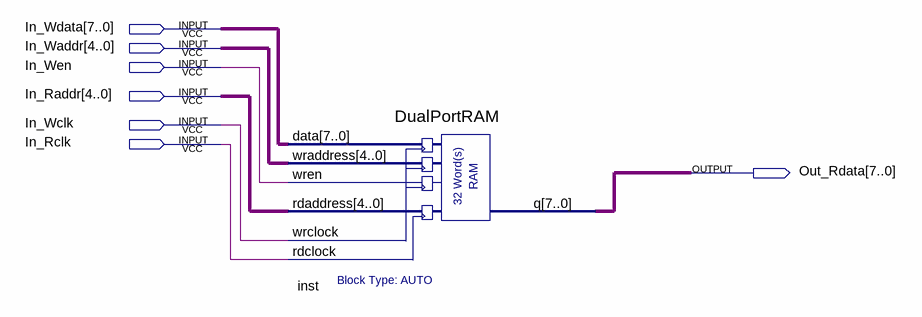
[diagram p0: schematic sheet]
// Quartus schematic TOP.bdf as structural Verilog: 1 symbols, 7 pins
module TOP (
  input  [7:0] In_Wdata,
  input  [4:0] In_Waddr,
  input  In_Wen,
  input  [4:0] In_Raddr,
  input  In_Wclk,
  input  In_Rclk,
  output [7:0] Out_Rdata
);

  DualPortRAM inst (
    .data(In_Wdata), .wraddress(In_Waddr), .wren(In_Wen), .rdaddress(In_Raddr), .wrclock(In_Wclk),
    .rdclock(In_Rclk), .q(Out_Rdata));
endmodule
